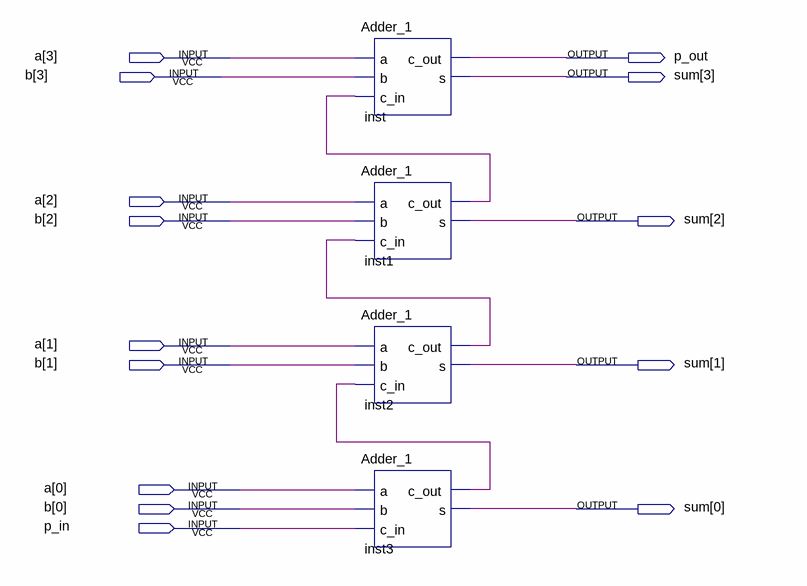
[diagram p0: schematic sheet]
// Quartus schematic Adder_1_a.bdf as structural Verilog: 4 symbols, 14 pins
module Adder_1_a (
  input  [3:0] a,
  input  [3:0] b,
  input  p_in,
  output p_out,
  output [3:0] sum
);

  wire inst1_c_out, inst2_c_out, inst3_c_out;

  Adder_1 inst (.a(a[3]), .b(b[3]), .c_in(inst1_c_out), .c_out(p_out), .s(sum[3]));
  Adder_1 inst1 (.a(a[2]), .b(b[2]), .c_in(inst2_c_out), .c_out(inst1_c_out), .s(sum[2]));
  Adder_1 inst2 (.a(a[1]), .b(b[1]), .c_in(inst3_c_out), .c_out(inst2_c_out), .s(sum[1]));
  Adder_1 inst3 (.a(a[0]), .b(b[0]), .c_in(p_in), .c_out(inst3_c_out), .s(sum[0]));
endmodule
